# EAGLE design modulo_sensores_routing_option1 (EAGLE 9.6.2)
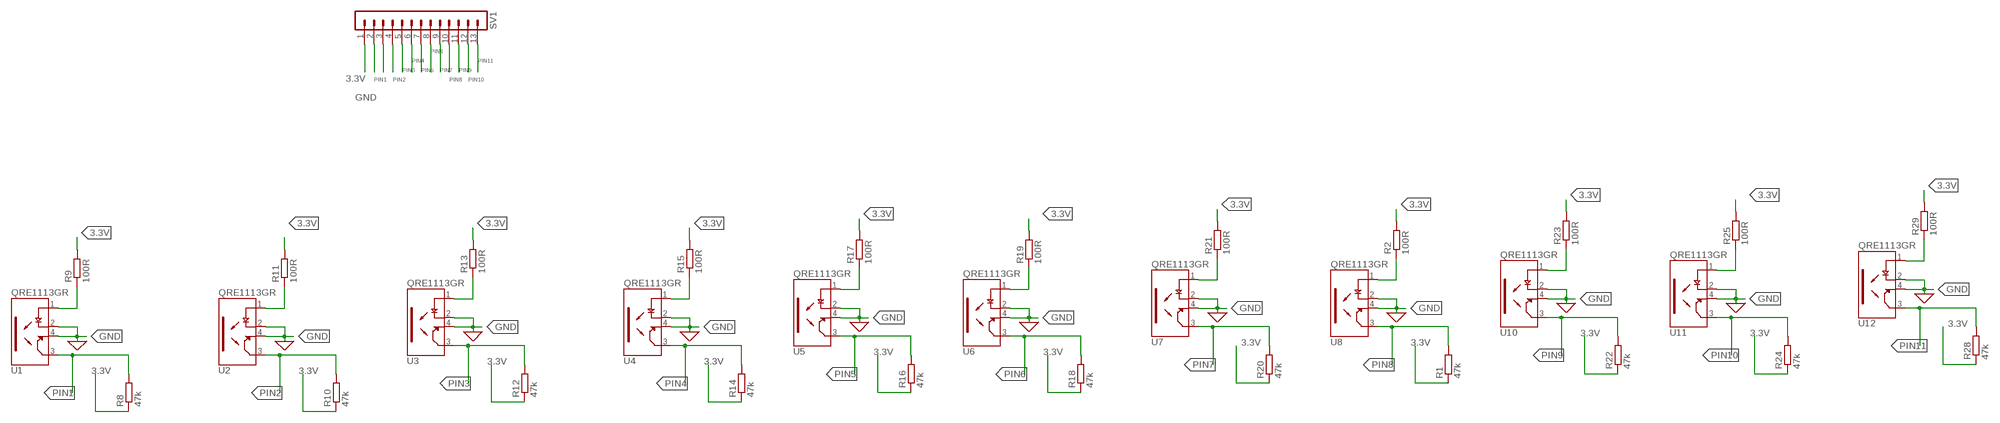
[diagram p0: schematic, sheet 1]

## Parts
R1  47k  R-EU_M0805  [M0805]
R2  100R  R-EU_M0805  [M0805]
R8  47k  R-EU_M0805  [M0805]
R9  100R  R-EU_M0805  [M0805]
R10  47k  R-EU_M0805  [M0805]
R11  100R  R-EU_M0805  [M0805]
R12  47k  R-EU_M0805  [M0805]
R13  100R  R-EU_M0805  [M0805]
R14  47k  R-EU_M0805  [M0805]
R15  100R  R-EU_M0805  [M0805]
R16  47k  R-EU_M0805  [M0805]
R17  100R  R-EU_M0805  [M0805]
R18  47k  R-EU_M0805  [M0805]
R19  100R  R-EU_M0805  [M0805]
R20  47k  R-EU_M0805  [M0805]
R21  100R  R-EU_M0805  [M0805]
R22  47k  R-EU_M0805  [M0805]
R23  100R  R-EU_M0805  [M0805]
R24  47k  R-EU_M0805  [M0805]
R25  100R  R-EU_M0805  [M0805]
R28  47k  R-EU_M0805  [M0805]
R29  100R  R-EU_M0805  [M0805]
SV1  MA13-1  [MA13-1]
U1  QRE1113GR  [SOIC180P460X187-4N]
U2  QRE1113GR  [SOIC180P460X187-4N]
U3  QRE1113GR  [SOIC180P460X187-4N]
U4  QRE1113GR  [SOIC180P460X187-4N]
U5  QRE1113GR  [SOIC180P460X187-4N]
U6  QRE1113GR  [SOIC180P460X187-4N]
U7  QRE1113GR  [SOIC180P460X187-4N]
U8  QRE1113GR  [SOIC180P460X187-4N]
U10  QRE1113GR  [SOIC180P460X187-4N]
U11  QRE1113GR  [SOIC180P460X187-4N]
U12  QRE1113GR  [SOIC180P460X187-4N]

## Nets
3.3V: R1.1 R2.2 R8.1 R9.2 R10.1 R11.2 R12.1 R13.2 R14.1 R15.2 R16.1 R17.2 R18.1 R19.2 R20.1 R21.2 R22.1 R23.2 R24.1 R25.2 R28.1 R29.2 SV1.1
GND: SV1.2 U1.2(C) U1.4(ET) U2.2(C) U2.4(ET) U3.2(C) U3.4(ET) U4.2(C) U4.4(ET) U5.2(C) U5.4(ET) U6.2(C) U6.4(ET) U7.2(C) U7.4(ET) U8.2(C) U8.4(ET) U10.2(C) U10.4(ET) U11.2(C) U11.4(ET) U12.2(C) U12.4(ET)
N$1: R9.1 U1.1(A)
N$6: R11.1 U2.1(A)
N$8: R13.1 U3.1(A)
N$9: R15.1 U4.1(A)
N$10: R17.1 U5.1(A)
N$11: R19.1 U6.1(A)
N$12: R21.1 U7.1(A)
N$13: R2.1 U8.1(A)
N$14: R23.1 U10.1(A)
N$16: R25.1 U11.1(A)
N$17: R29.1 U12.1(A)
PIN1: R8.2 SV1.3 U1.3(CT)
PIN2: R10.2 SV1.4 U2.3(CT)
PIN3: R12.2 SV1.5 U3.3(CT)
PIN4: R14.2 SV1.6 U4.3(CT)
PIN5: R16.2 SV1.7 U5.3(CT)
PIN6: R18.2 SV1.8 U6.3(CT)
PIN7: R20.2 SV1.9 U7.3(CT)
PIN8: R1.2 SV1.10 U8.3(CT)
PIN9: R22.2 SV1.11 U10.3(CT)
PIN10: R24.2 SV1.12 U11.3(CT)
PIN11: R28.2 SV1.13 U12.3(CT)

## Library data of the parts
R1 R2 R8-R25 R28 R29 = rcl:R-EU_: RESISTOR, European symbol; SPICEPREFIX: R
SV1 = con-lstb:MA13-1: PIN HEADER; OC_FARNELL: unknown; OC_NEWARK: unknown
U1-U8 U10-U12 = QRE_SENSOR:QRE1113GR: QRE1113 Series 30 V 50 mA Miniature Reflective Object Sensor - SMD-4 Check prices <https://pricing.snapeda.com/parts/QRE1113GR/ON%20Semiconductor/view-part?ref=eda>; AVAILABILITY: In Stock; DESCRIPTION: Reflective Optical Sensor 0.039 (1mm) 4-SMD, Gull Wing; MF: ON Semiconductor; MP: QRE1113GR; PACKAGE: ARUSM-313-4 ON Semiconductor; PRICE: None; PURCHASE-URL: https://pricing.snapeda.com/search/part/QRE1113GR/?ref=eda

## Board
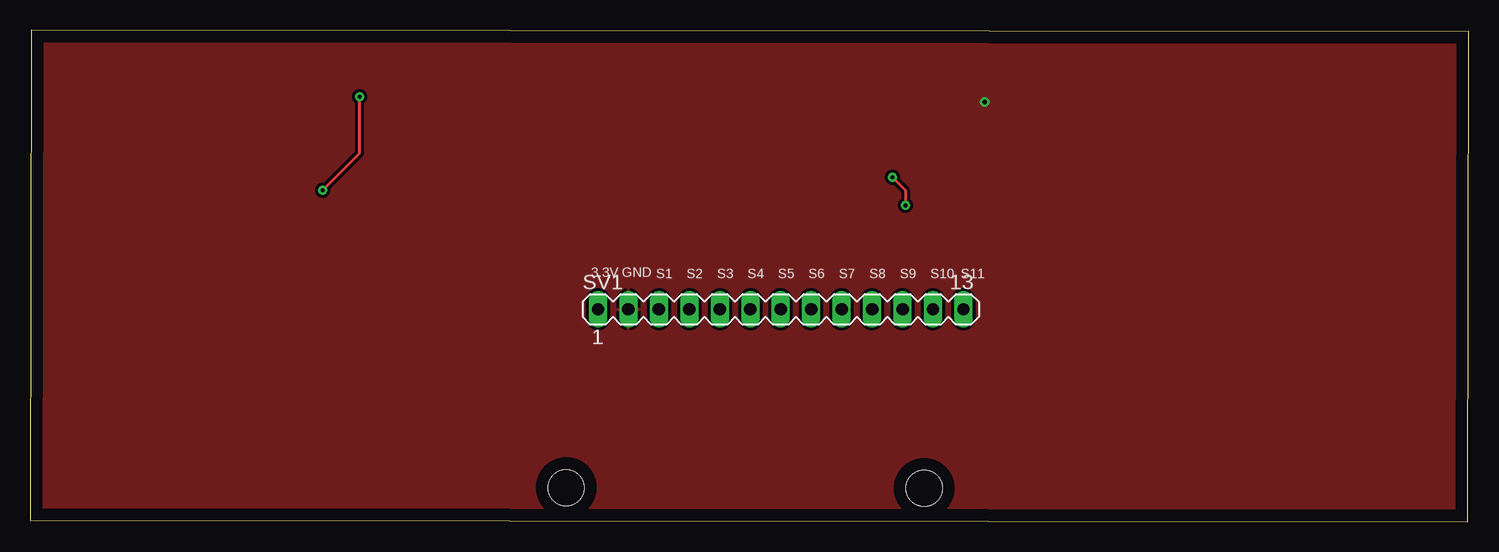
[diagram p1: board, top side]
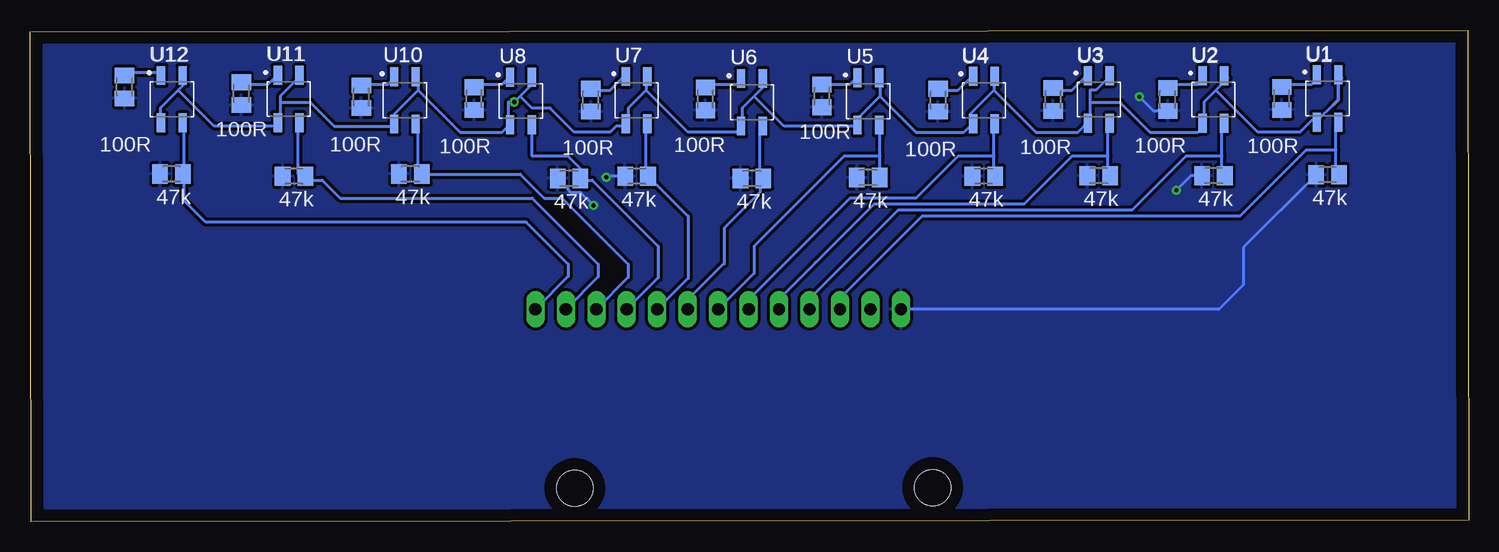
[diagram p2: board, bottom side, seen from below]

Size 119.95 x 40.98 mm. Coordinates in mm from the lower left corner, seen from the top.
Outline: 0,0.13 119.87,0 119.95,40.85 0.08,40.98 0,0.13
Copper layers (1*16): Top 0.035mm / dielectric 1.5mm / Bottom 0.035mm
Design rules "default *": minimum track width 0.25mm, minimum drill 0.35mm, track to track 0.25mm, track to pad 0.25mm, pad to pad 0.25mm, via to via 0.25mm, smd to smd 0.25mm, copper to edge 40mil, drill to drill 6mil, minimum pad ring 10mil, minimum via ring 8mil, stop-mask expansion 4mil, vias tented up to drill 0mil, thermal gap 10mil
Holes 3 mm at 74.54,2.79 44.7,2.84

### Footprints (pad centres in the part's own frame; a part is rotated, then mirrored left to right if it is on the bottom)
M0805 = smd 1.3 x 1.6: 1 -0.95,0; 2 0.95,0
MA13-1 = drill 1.016 long: 1 -15.24,0; 2 -12.7,0; 3 -10.16,0; 4 -7.62,0; 5 -5.08,0; 6 -2.54,0; 7 0,0; 8 2.54,0; 9 5.08,0; 10 7.62,0; 11 10.16,0; 12 12.7,0; 13 15.24,0
SOIC180P460X187-4N = smd 0.69 x 1.57: 1 -0.9,1.975; 2 -0.9,-1.975; 3 0.9,-1.975; 4 0.9,1.975

### Placement (x,y rotation side)
R1  75.01,28.61 0 bottom
R2  82.94,35.25 270 bottom
R8  11.79,28.92 0 bottom
R9  15.6,35.27 270 bottom
R10  21.3,28.84 0 bottom
R11  25.11,35.19 270 bottom
R12  30.86,28.84 0 bottom
R13  34.67,35.19 270 bottom
R14  40.44,28.79 0 bottom
R15  44.25,35.14 270 bottom
R16  50.07,28.68 0 bottom
R17  53.93,35.49 270 bottom
R18  59.77,28.61 0 bottom
R19  63.65,35.24 270 bottom
R20  69.38,28.78 0 bottom
R21  73.19,35.13 270 bottom
R22  88.24,28.99 0 bottom
R23  92.33,35.41 270 bottom
R24  97.93,28.8 0 bottom
R25  102.33,35.68 270 bottom
R28  108.15,28.98 0 bottom
R29  112.07,36.23 270 bottom
SV1  62.58,17.7 0 top
U1  11.79,35.27 0 bottom
U2  21.3,35.19 0 bottom
U3  30.86,35.19 0 bottom
U4  40.44,35.14 0 bottom
U5  50.07,35.03 0 bottom
U6  59.77,34.96 0 bottom
U7  69.38,35.13 0 bottom
U8  79.03,35.06 0 bottom
U10  88.7,35.12 0 bottom
U11  98.39,35.23 0 bottom
U12  108.12,35.21 0 bottom

### Tracks (layer width: path | path; a pad name or v marks a point on that pad's centre or on a via)
3.3V  (via drill 0.35)
  Top 0.25: v24.39,27.62 27.48,30.71 v27.48,35.42
  Top 0.254: v71.91,28.71 72.98,27.64 v72.98,26.36
  Bottom 0.25: R10.1 23.17,28.84 v24.39,27.62 | v27.48,35.42 26.29,34.24 R11.2
  Bottom 0.254: R8.1 18.8,22.86 18.8,19.76 20.86,17.7 SV1.1 | R20.1 71.84,28.78 v71.91,28.71 | v72.98,26.36 74.05,27.43 74.87,27.43 75.09,27.65 75.09,27.73 R1.1
  pour Bottom: -2.57,2.42 -2.57,42.85 122.83,42.85 122.83,-1.23 -3.76,-1.23 -3.76,2.42
GND  (via drill 0.35)
  Bottom 0.25: 79.08,35.48 78.08,36.48 78.08,36.98 U8.4 | 79.08,35.48 v79.58,34.98 80.08,34.98 80.08,33.48 U8.2 80.08,32.98 80.58,32.48 84.08,32.48 87.58,35.98 | 87.58,35.98 89.58,33.98 89.58,33.48 U10.2 89.58,32.98 94.58,32.98 96.58,34.98 99.08,34.98 | 87.58,35.98 87.58,36.98 U10.4 | 107.58,35.98 109.08,34.48 109.08,33.48 U12.2 | 107.58,35.98 107.08,36.48 107.08,36.98 U12.4 | 99.08,34.98 99.08,35.48 97.58,36.98 U11.4 | 99.08,34.98 99.08,33.48 U11.2 99.58,32.98 104.58,32.98 107.58,35.98 | 21.08,35.98 22.08,34.98 22.08,33.48 U2.2 22.08,32.98 22.58,32.48 26.58,32.48 29.08,34.98 31.58,34.98 | 21.08,35.98 20.08,36.98 U2.4 | 10.58,36.98 U1.4 | 11.1,34.98 11.37,34.71 12.58,33.49 12.58,33.48 | 21.08,35.98 17.58,32.48 14.08,32.48 13.08,33.48 12.58,33.48 | 12.58,33.48 U1.2 | 31.58,34.98 31.58,35.98 31.08,35.98 30.08,36.98 U3.4 | 31.58,34.98 31.58,33.48 U3.2 32.08,32.98 32.58,32.48 36.08,32.48 39.58,35.98 | 39.58,35.98 41.58,33.98 41.58,33.48 U4.2 41.58,32.98 42.08,32.48 46.08,32.48 49.08,35.48 | 39.58,35.98 39.58,36.98 U4.4 | 68.58,35.98 70.08,34.48 70.08,33.48 U7.2 70.58,32.98 71.08,32.98 71.58,32.48 74.58,32.48 76.58,34.48 78.08,34.48 79.08,35.48 | 68.58,35.98 68.58,36.98 U7.4 | 59.58,35.48 60.58,34.48 60.58,33.48 U6.2 60.58,32.98 61.08,32.48 65.08,32.48 68.58,35.98 | 59.58,35.48 58.58,36.48 U6.4 | 49.08,35.48 51.08,33.48 U5.2 51.08,32.98 57.08,32.98 59.58,35.48 | 49.08,35.48 49.08,36.98 U5.4
  Bottom 0.305: 11.37,34.71 10.89,35.19 U1.4
  pour Top: -1.18,-0.74 -1.18,41.77 121.63,41.83 121.63,-0.77
N$1
  Bottom 0.25: U1.1 12.58,36.98 13.08,36.48 15.58,36.48 R9.1
N$6
  Bottom 0.25: U2.1 22.08,36.98 22.58,36.48 25.08,36.48 R11.1
N$8
  Bottom 0.25: U3.1 32.08,36.98 33.08,35.98 34.58,35.98 R13.1
N$9
  Bottom 0.25: U4.1 41.58,36.98 42.58,35.98 44.08,35.98 R15.1
N$10
  Bottom 0.25: U5.1 51.08,36.98 51.58,36.48 53.58,36.48 R17.1
N$11
  Bottom 0.25: U6.1 60.58,36.48 63.58,36.48 R19.1
N$12
  Bottom 0.25: U7.1 70.58,36.98 71.58,35.98 73.08,35.98 R21.1
N$13
  Bottom 0.25: U8.1 80.08,36.98 80.58,36.48 82.58,36.48 R2.1
N$14
  Bottom 0.25: U10.1 89.58,36.98 90.08,36.48 92.08,36.48 R23.1
N$16
  Bottom 0.25: U11.1 99.58,36.98 100.08,36.48 102.08,36.48 R25.1
N$17
  Bottom 0.25: U12.1 109.08,37.48 111.58,37.48 R29.1
PIN1
  Bottom 0.25: 11.08,30.98 11.08,28.98 R8.2 | 11.08,30.98 11.08,32.98 U1.3 | 49.58,21.48 49.42,21.64 45.58,25.48 19.08,25.48 13.58,30.98 11.08,30.98
  Bottom 0.254: 49.42,21.64 52.42,18.64 SV1.3
PIN2
  Bottom 0.25: 20.58,30.48 20.58,28.98 R10.2 | 20.58,30.48 20.58,32.98 U2.3 | 52.08,21.48 51.96,21.6 47.58,25.98 28.08,25.98 23.58,30.48 20.58,30.48
  Bottom 0.254: 51.96,21.6 54.96,18.6 SV1.4
PIN3
  Bottom 0.25: 30.08,30.48 30.08,28.98 R12.2 | 30.08,30.48 30.08,32.98 U3.3 | 54.58,21.48 54.48,21.58 49.58,26.48 37.08,26.48 33.08,30.48 30.08,30.48
  Bottom 0.254: 54.48,21.58 57.5,18.56 SV1.5
PIN4
  Bottom 0.25: 39.58,30.48 39.58,28.98 R14.2 | 39.58,30.48 39.58,32.98 U4.3 | 57.08,21.48 51.58,26.98 46.08,26.98 42.58,30.48 39.58,30.48
  Bottom 0.254: SV1.6 60.04,18.52 57.08,21.48
PIN5
  Bottom 0.25: 49.08,30.48 49.08,28.98 R16.2 | 49.08,30.48 49.08,32.98 U5.3 | 59.58,21.48 59.58,22.98 52.08,30.48 49.08,30.48
  Bottom 0.254: 59.58,21.48 59.58,20.7 SV1.7
PIN6
  Bottom 0.25: U6.3 59.08,32.98 59.08,28.98 R18.2 59.08,28.48 59.08,27.48 62.08,24.48 62.08,21.52 62.08,21.48
  Bottom 0.254: 62.08,21.52 65.12,18.48 SV1.8
PIN7
  Bottom 0.25: U7.3 68.58,32.98 68.58,28.98 R20.2 68.08,28.48 65.08,25.48 65.08,21.48
  Bottom 0.254: 65.08,21.48 65.08,20.28 SV1.9
PIN8
  Bottom 0.25: U8.3 78.08,32.98 78.08,30.48 75.08,30.48 73.58,28.98 R1.2 73.58,28.48 73.08,28.48 67.58,22.98 67.58,21.48
  Bottom 0.254: 67.58,21.48 67.58,20.32 SV1.10
PIN9
  Bottom 0.25: U10.3 87.58,32.98 87.58,29.48 R22.2 87.08,28.98 79.08,28.98 77.08,26.98 75.58,26.98 70.08,21.48
  Bottom 0.254: 70.08,21.48 70.08,20.36 SV1.11
PIN10
  Bottom 0.25: U11.3 97.58,32.98 97.58,28.98 97.08,28.98 R24.2 96.58,28.48 95.58,28.48 94.08,26.98 78.08,26.98 72.58,21.48
  Bottom 0.254: 72.58,21.48 72.58,20.4 SV1.12
PIN11
  Bottom 0.25: U12.3 107.08,32.98 107.08,29.48 R28.2 107.08,28.98 107.08,26.76 105.3,24.98 78.58,24.98 75.08,21.48
  Bottom 0.254: 75.08,21.48 75.08,20.44 SV1.13

### Text on the board
_tNames: 3.3V | GND | S1 | S2 | S3 | S4 | S5 | S6 | S7 | S8 | S9 | S10 | S11
_bNames: U1 | U1 | U2 | U2 | U3 | U3 | U7 | U10 | U11 | U12 | U4 | U4 | U5 | U5 | U6 | U6 | U8 | U8